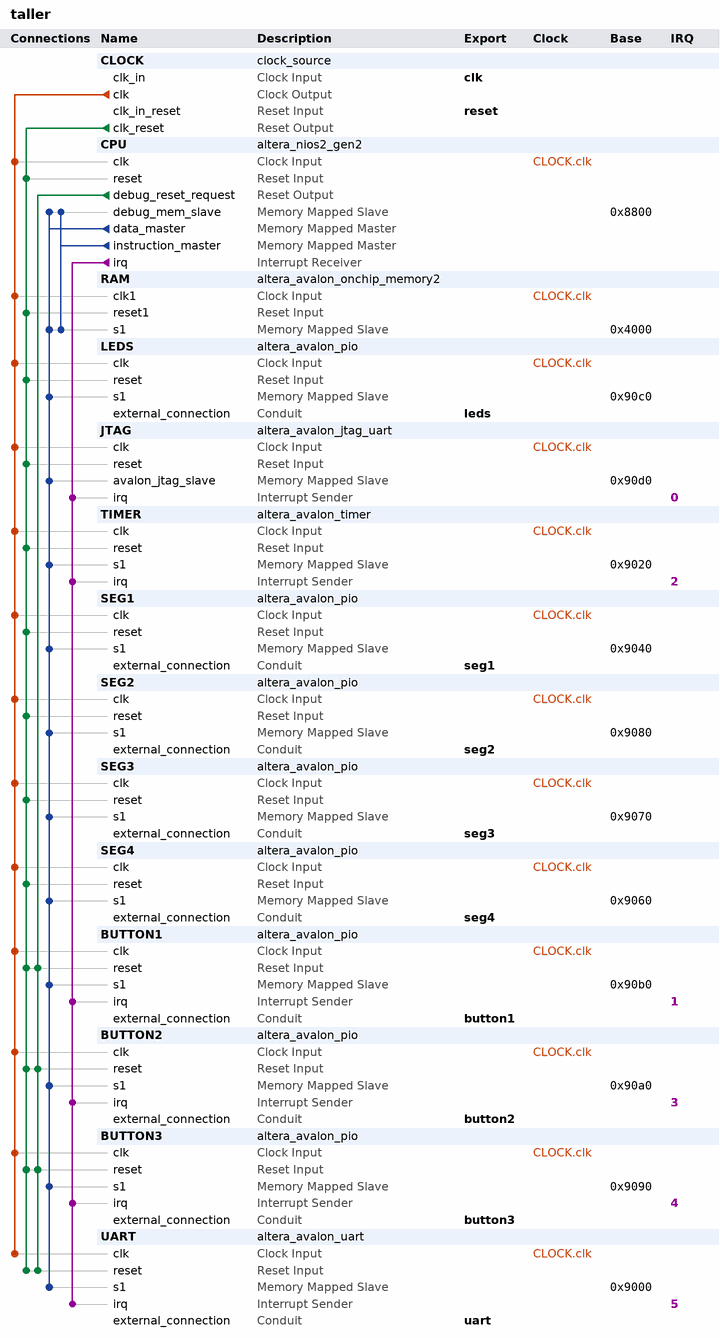
[diagram p0: system contents]
# Platform Designer (Qsys) system taller, Cyclone V 5CSEMA5F31C6
# Parameters at their usual value, and those the tool derives, are not listed.
package require -exact qsys 18.0
create_system taller
set_project_property DEVICE_FAMILY {Cyclone V}
set_project_property DEVICE 5CSEMA5F31C6

add_instance CLOCK clock_source 18.0
set_instance_parameter_value CLOCK clockFrequency 50000000

add_instance CPU altera_nios2_gen2 18.0
set_instance_parameter_value CPU dcache_size 2048
set_instance_parameter_value CPU exceptionSlave RAM.s1
set_instance_parameter_value CPU icache_size 4096
set_instance_parameter_value CPU impl Tiny
set_instance_parameter_value CPU resetSlave RAM.s1

add_instance RAM altera_avalon_onchip_memory2 18.0
set_instance_parameter_value RAM dataWidth 32
set_instance_parameter_value RAM dualPort false
set_instance_parameter_value RAM initMemContent true
set_instance_parameter_value RAM initializationFileName onchip_mem.hex
set_instance_parameter_value RAM memorySize 16384

add_instance LEDS altera_avalon_pio 18.0
set_instance_parameter_value LEDS direction Output
set_instance_parameter_value LEDS width 8

add_instance JTAG altera_avalon_jtag_uart 18.0
set_instance_parameter_value JTAG simInteractiveOptions NO_INTERACTIVE_WINDOWS

add_instance TIMER altera_avalon_timer 18.0
set_instance_parameter_value TIMER fixedPeriod true
set_instance_parameter_value TIMER period 1
set_instance_parameter_value TIMER periodUnits SEC
set_instance_parameter_value TIMER snapshot false
set_instance_parameter_value TIMER timeoutPulseOutput true

add_instance SEG1 altera_avalon_pio 18.0
set_instance_parameter_value SEG1 bitModifyingOutReg true
set_instance_parameter_value SEG1 direction Output
set_instance_parameter_value SEG1 width 7

add_instance SEG2 altera_avalon_pio 18.0
set_instance_parameter_value SEG2 direction Output
set_instance_parameter_value SEG2 width 7

add_instance SEG3 altera_avalon_pio 18.0
set_instance_parameter_value SEG3 direction Output
set_instance_parameter_value SEG3 width 7

add_instance SEG4 altera_avalon_pio 18.0
set_instance_parameter_value SEG4 direction Output
set_instance_parameter_value SEG4 width 7

add_instance BUTTON1 altera_avalon_pio 18.0
set_instance_parameter_value BUTTON1 captureEdge true
set_instance_parameter_value BUTTON1 direction Input
set_instance_parameter_value BUTTON1 edgeType FALLING
set_instance_parameter_value BUTTON1 generateIRQ true
set_instance_parameter_value BUTTON1 irqType EDGE
set_instance_parameter_value BUTTON1 width 1

add_instance BUTTON2 altera_avalon_pio 18.0
set_instance_parameter_value BUTTON2 captureEdge true
set_instance_parameter_value BUTTON2 direction Input
set_instance_parameter_value BUTTON2 edgeType FALLING
set_instance_parameter_value BUTTON2 generateIRQ true
set_instance_parameter_value BUTTON2 irqType EDGE
set_instance_parameter_value BUTTON2 width 1

add_instance BUTTON3 altera_avalon_pio 18.0
set_instance_parameter_value BUTTON3 captureEdge true
set_instance_parameter_value BUTTON3 direction Input
set_instance_parameter_value BUTTON3 edgeType FALLING
set_instance_parameter_value BUTTON3 generateIRQ true
set_instance_parameter_value BUTTON3 irqType EDGE
set_instance_parameter_value BUTTON3 width 1

add_instance UART altera_avalon_uart 18.0
set_instance_parameter_value UART baud 115200
set_instance_parameter_value UART dataBits 8
set_instance_parameter_value UART fixedBaud true
set_instance_parameter_value UART parity NONE
set_instance_parameter_value UART stopBits 1

# connections
add_connection CLOCK.clk BUTTON1.clk clock
add_connection CLOCK.clk BUTTON2.clk clock
add_connection CLOCK.clk BUTTON3.clk clock
add_connection CLOCK.clk CPU.clk clock
add_connection CLOCK.clk JTAG.clk clock
add_connection CLOCK.clk LEDS.clk clock
add_connection CLOCK.clk RAM.clk1 clock
add_connection CLOCK.clk SEG1.clk clock
add_connection CLOCK.clk SEG2.clk clock
add_connection CLOCK.clk SEG3.clk clock
add_connection CLOCK.clk SEG4.clk clock
add_connection CLOCK.clk TIMER.clk clock
add_connection CLOCK.clk UART.clk clock
add_connection CLOCK.clk_reset BUTTON1.reset reset
add_connection CLOCK.clk_reset BUTTON2.reset reset
add_connection CLOCK.clk_reset BUTTON3.reset reset
add_connection CLOCK.clk_reset CPU.reset reset
add_connection CLOCK.clk_reset JTAG.reset reset
add_connection CLOCK.clk_reset LEDS.reset reset
add_connection CLOCK.clk_reset RAM.reset1 reset
add_connection CLOCK.clk_reset SEG1.reset reset
add_connection CLOCK.clk_reset SEG2.reset reset
add_connection CLOCK.clk_reset SEG3.reset reset
add_connection CLOCK.clk_reset SEG4.reset reset
add_connection CLOCK.clk_reset TIMER.reset reset
add_connection CLOCK.clk_reset UART.reset reset
add_connection CPU.debug_reset_request BUTTON1.reset reset
add_connection CPU.debug_reset_request BUTTON2.reset reset
add_connection CPU.debug_reset_request BUTTON3.reset reset
add_connection CPU.debug_reset_request UART.reset reset
add_connection CPU.data_master BUTTON1.s1 avalon
set_connection_parameter_value CPU.data_master/BUTTON1.s1 baseAddress 0x90b0
add_connection CPU.data_master BUTTON2.s1 avalon
set_connection_parameter_value CPU.data_master/BUTTON2.s1 baseAddress 0x90a0
add_connection CPU.data_master BUTTON3.s1 avalon
set_connection_parameter_value CPU.data_master/BUTTON3.s1 baseAddress 0x9090
add_connection CPU.data_master CPU.debug_mem_slave avalon
set_connection_parameter_value CPU.data_master/CPU.debug_mem_slave baseAddress 0x8800
add_connection CPU.data_master JTAG.avalon_jtag_slave avalon
set_connection_parameter_value CPU.data_master/JTAG.avalon_jtag_slave baseAddress 0x90d0
add_connection CPU.data_master LEDS.s1 avalon
set_connection_parameter_value CPU.data_master/LEDS.s1 baseAddress 0x90c0
add_connection CPU.data_master RAM.s1 avalon
set_connection_parameter_value CPU.data_master/RAM.s1 baseAddress 0x4000
add_connection CPU.data_master SEG1.s1 avalon
set_connection_parameter_value CPU.data_master/SEG1.s1 baseAddress 0x9040
add_connection CPU.data_master SEG2.s1 avalon
set_connection_parameter_value CPU.data_master/SEG2.s1 baseAddress 0x9080
add_connection CPU.data_master SEG3.s1 avalon
set_connection_parameter_value CPU.data_master/SEG3.s1 baseAddress 0x9070
add_connection CPU.data_master SEG4.s1 avalon
set_connection_parameter_value CPU.data_master/SEG4.s1 baseAddress 0x9060
add_connection CPU.data_master TIMER.s1 avalon
set_connection_parameter_value CPU.data_master/TIMER.s1 baseAddress 0x9020
add_connection CPU.data_master UART.s1 avalon
set_connection_parameter_value CPU.data_master/UART.s1 baseAddress 0x9000
add_connection CPU.instruction_master CPU.debug_mem_slave avalon
set_connection_parameter_value CPU.instruction_master/CPU.debug_mem_slave baseAddress 0x8800
add_connection CPU.instruction_master RAM.s1 avalon
set_connection_parameter_value CPU.instruction_master/RAM.s1 baseAddress 0x4000
add_connection CPU.irq BUTTON1.irq interrupt
set_connection_parameter_value CPU.irq/BUTTON1.irq irqNumber 1
add_connection CPU.irq BUTTON2.irq interrupt
set_connection_parameter_value CPU.irq/BUTTON2.irq irqNumber 3
add_connection CPU.irq BUTTON3.irq interrupt
set_connection_parameter_value CPU.irq/BUTTON3.irq irqNumber 4
add_connection CPU.irq JTAG.irq interrupt
set_connection_parameter_value CPU.irq/JTAG.irq irqNumber 0
add_connection CPU.irq TIMER.irq interrupt
set_connection_parameter_value CPU.irq/TIMER.irq irqNumber 2
add_connection CPU.irq UART.irq interrupt
set_connection_parameter_value CPU.irq/UART.irq irqNumber 5

# exported interfaces
add_interface button1 conduit end
set_interface_property button1 EXPORT_OF BUTTON1.external_connection
add_interface button2 conduit end
set_interface_property button2 EXPORT_OF BUTTON2.external_connection
add_interface button3 conduit end
set_interface_property button3 EXPORT_OF BUTTON3.external_connection
add_interface clk clock sink
set_interface_property clk EXPORT_OF CLOCK.clk_in
add_interface leds conduit end
set_interface_property leds EXPORT_OF LEDS.external_connection
add_interface reset reset sink
set_interface_property reset EXPORT_OF CLOCK.clk_in_reset
add_interface seg1 conduit end
set_interface_property seg1 EXPORT_OF SEG1.external_connection
add_interface seg2 conduit end
set_interface_property seg2 EXPORT_OF SEG2.external_connection
add_interface seg3 conduit end
set_interface_property seg3 EXPORT_OF SEG3.external_connection
add_interface seg4 conduit end
set_interface_property seg4 EXPORT_OF SEG4.external_connection
add_interface uart conduit end
set_interface_property uart EXPORT_OF UART.external_connection

set_interconnect_requirement {$system} qsys_mm.clockCrossingAdapter HANDSHAKE
set_interconnect_requirement {$system} qsys_mm.enableEccProtection FALSE
set_interconnect_requirement {$system} qsys_mm.insertDefaultSlave FALSE
set_interconnect_requirement {$system} qsys_mm.maxAdditionalLatency 1

save_system taller.qsys
